# Altium schematic sheet CPU.SchDoc
size A
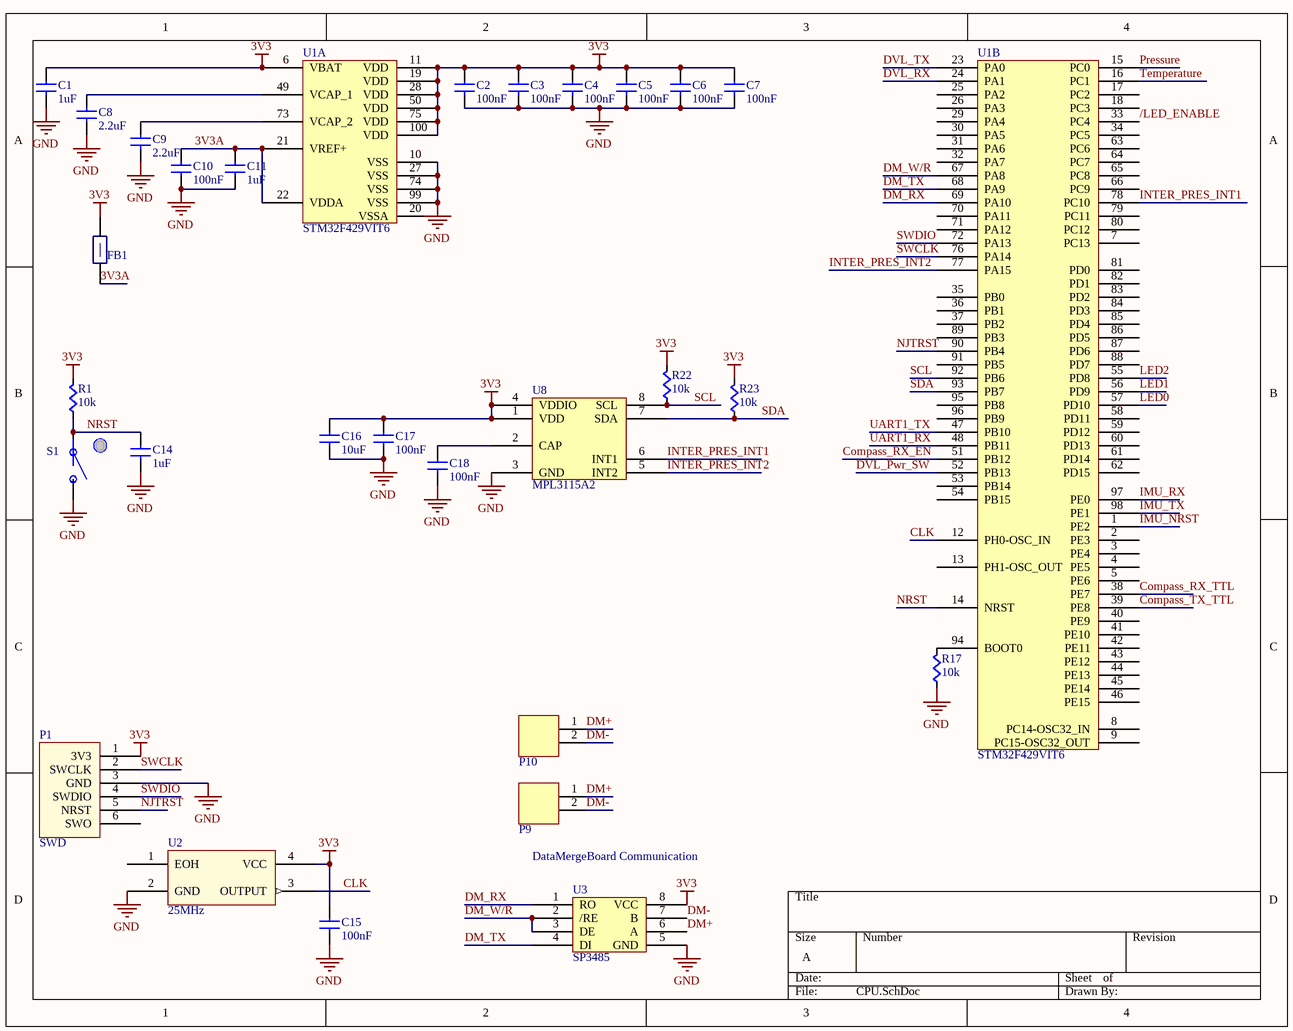
[diagram p0: CPU.SchDoc]

## Parts
C1  value 1uF  [CAPC0603]  (hidden comment: Cap)
C2  value 100nF  [CAPC0603]  (hidden comment: Cap)
C3  value 100nF  [CAPC0603]  (hidden comment: Cap)
C4  value 100nF  [CAPC0603]  (hidden comment: Cap)
C5  value 100nF  [CAPC0603]  (hidden comment: Cap)
C6  value 100nF  [CAPC0603]  (hidden comment: Cap)
C7  value 100nF  [CAPC0603]  (hidden comment: Cap)
C8  value 2.2uF  [CAPC0603]  (hidden comment: Cap)
C9  value 2.2uF  [CAPC0603]  (hidden comment: Cap)
C10  value 100nF  [CAPC0603]  (hidden comment: Cap)
C11  value 1uF  [CAPC0603]  (hidden comment: Cap)
C14  value 1uF  [CAPC0603]  (hidden comment: Cap)
C15  value 100nF  [CAPC0603]  (hidden comment: Cap)
C16  value 10uF  [CAPC0603]  (hidden comment: Cap)
C17  value 100nF  [CAPC0603]  (hidden comment: Cap)
C18  value 100nF  [CAPC0603]  (hidden comment: Cap)
FB1  FBead  [RES0603]  (value not drawn)
P1  SWD  [SWD_STM32]
P9  2-pin Horz Sherlock  [MOLEX-HDR-1X2-SHERLOCK-HORZ]  (value not drawn)
P10  2-pin Horz Sherlock  [MOLEX-HDR-1X2-SHERLOCK-HORZ]  (value not drawn)
R1  value 10k  [RES0603]  (hidden comment: Res)
R17  value 10k  [RES0603]  (hidden comment: Res)
R22  value 10k  [RES0603]  (hidden comment: Res)
R23  value 10k  [RES0603]  (hidden comment: Res)
S1  Button  [PTS645xxxxSMTR92]  (value not drawn)
U1  STM32F429VIT6  [STM32F429VIT6]  (parts A,B of 2)
U2  25MHz  [636L3C]
U3  SP3485  [SP3485]
U8  MPL3115A2  [MPL3115A2]

## Nets
3V3: C1.1(A) C2.1(A) C3.1(A) C4.1(A) C5.1(A) C6.1(A) C7.1(A) C15.1(A) C16.1(A) C17.1(A) FB1.2(B) P1.1(3V3) R1.1(A) R22.1(A) R23.1(A) U1.6(VBAT) U1.11(VDD) U1.19(VDD) U1.28(VDD) U1.50(VDD) U1.75(VDD) U1.100(VDD) U2.4(VCC) U3.8(VCC) U8.1(VDD) U8.4(VDDIO)
GND: C1.2(B) C2.2(B) C3.2(B) C4.2(B) C5.2(B) C6.2(B) C7.2(B) C8.2(B) C9.2(B) C10.2(B) C11.2(B) C14.2(B) C15.2(B) C16.2(B) C17.2(B) C18.2(B) P1.3(GND) R17.2(B) S1.B U1.10(VSS) U1.27(VSS) U1.74(VSS) U1.99(VSS) U2.2(GND) U3.5(GND) U8.3(GND)
3V3A: C10.1(A) C11.1(A) FB1.1(A) U1.21(VREF+) U1.22(VDDA)
/LED_ENABLE: U1.33(PC4)
CLK: U1.12(PH0-OSC_IN) U2.3(OUTPUT)
Compass_RX_EN: U1.51(PB12)
Compass_RX_TTL: U1.38(PE7)
Compass_TX_TTL: U1.39(PE8)
DM+: P9.1 P10.1 U3.6(A)
DM-: P9.2 P10.2 U3.7(B)
DM_RX: U1.69(PA10) U3.1(RO)
DM_TX: U1.68(PA9) U3.4(DI)
DM_W/R: U1.67(PA8) U3.2(/RE) U3.3(DE)
DVL_Pwr_SW: U1.52(PB13)
DVL_RX: U1.24(PA1)
DVL_TX: U1.23(PA0)
IMU_NRST: U1.1(PE2)
IMU_RX: U1.97(PE0)
IMU_TX: U1.98(PE1)
INTER_PRES_INT1: U1.78(PC10) U8.6(INT1)
INTER_PRES_INT2: U1.77(PA15) U8.5(INT2)
LED0: U1.57(PD10)
LED1: U1.56(PD9)
LED2: U1.55(PD8)
NJTRST: P1.5(NRST) U1.90(PB4)
NRST: C14.1(A) R1.2(B) S1.A U1.14(NRST)
Pressure: U1.15(PC0)
SCL: R22.2(B) U1.92(PB6) U8.8(SCL)
SDA: R23.2(B) U1.93(PB7) U8.7(SDA)
SWCLK: P1.2(SWCLK) U1.76(PA14)
SWDIO: P1.4(SWDIO) U1.72(PA13)
Temperature: U1.16(PC1)
UART1_RX: U1.48(PB11)
UART1_TX: U1.47(PB10)
NetC8_1: C8.1(A) U1.49(VCAP_1)
NetC9_1: C9.1(A) U1.73(VCAP_2)
NetC18_1: C18.1(A) U8.2(CAP)
NetR17_1: R17.1(A) U1.94(BOOT0)

Not connected (* = marked no-connect by the designer): P1 6(SWO); U1 2(PE3) 3(PE4) 4(PE5) 5(PE6) 7(PC13) 8(PC14-OSC32_IN) 9(PC15-OSC32_OUT) 13(PH1-OSC_OUT) 17(PC2) 18(PC3) 20(VSSA) 25(PA2) 26(PA3) 29(PA4) 30(PA5) 31(PA6) 32(PA7) 34(PC5) 35(PB0) 36(PB1) 37(PB2) 40(PE9) 41(PE10) 42(PE11) 43(PE12) 44(PE13) 45(PE14) 46(PE15) 53(PB14) 54(PB15) 58(PD11) 59(PD12) 60(PD13) 61(PD14) 62(PD15) 63(PC6) 64(PC7) 65(PC8) 66(PC9) 70(PA11) 71(PA12) 79(PC11) 80(PC12) 81(PD0) 82(PD1) 83(PD2) 84(PD3) 85(PD4) 86(PD5) 87(PD6) 88(PD7) 89(PB3) 91(PB5) 95(PB8) 96(PB9); U2 1(EOH)

## Notes on the sheet
- DataMergeBoard Communication

## Library data of the parts
FB1 = FBead: Ferrite Bead; Supplier 1: Digi-Key; Supplier Part Number 1: 445-2988-1-ND
P1 = SWD_STM32: SWD connector matching the pinout on STM Discovery Boards
P9 P10 = MOLEX-HDR-1x2-SHERLOCK_RA: Header, Molex, 2mm Pitch Sherlock Header, Single Row, Horizontal, 2 Circuits, Length 3.3mm,  0353630260; Manufacturer: Molex Inc; Manufacturer Part Number: 0353630260; Supplier Part Number 1: WM18931-ND; Supplier 1: Digi-Key
S1 = Button: SPST Button; Supplier 1: Digi-Key; Supplier Part Number 1: CKN9087CT-ND
U1 = STM32F429VIT6: IC MCU ARM 2MB FLASH 100LQFP; Supplier 1: Digi-Key; Supplier Part Number 1: 497-14052-ND
U2 = 636L3C: HCMOS/TTL Clock Oscillator; Supplier 1: Digi-Key; Supplier Part Number 1: CTX697CT-ND
U3 = SP3485: IC TXRX RS485 HALF DUPLEX 8NSOIC; Supplier 1: Digi-Key; Supplier Part Number 1: 1016-1817-1-ND
U8 = MPL3115A2: IC ALTIMETER I2C VERSION 8LGA; Supplier 1: Digi-Key; Supplier Part Number 1: MPL3115A2R1CT-ND
C1-C11 C14-C18 = Cap: Supplier 1: Digi-Key
  C1 C11 C14: Supplier Part Number 1: 1276-1946-1-ND
  C2-C7 C10 C15 C17 C18: Supplier Part Number 1: 1276-1000-1-ND
  C8 C9: Supplier Part Number 1: 587-1254-1-ND
  C16: Supplier Part Number 1: 490-6405-1-ND
R1 R17 R22 R23 = Res: Supplier 1: Digi-Key; Supplier Part Number 1: RMCF0603JT10K0CT-ND